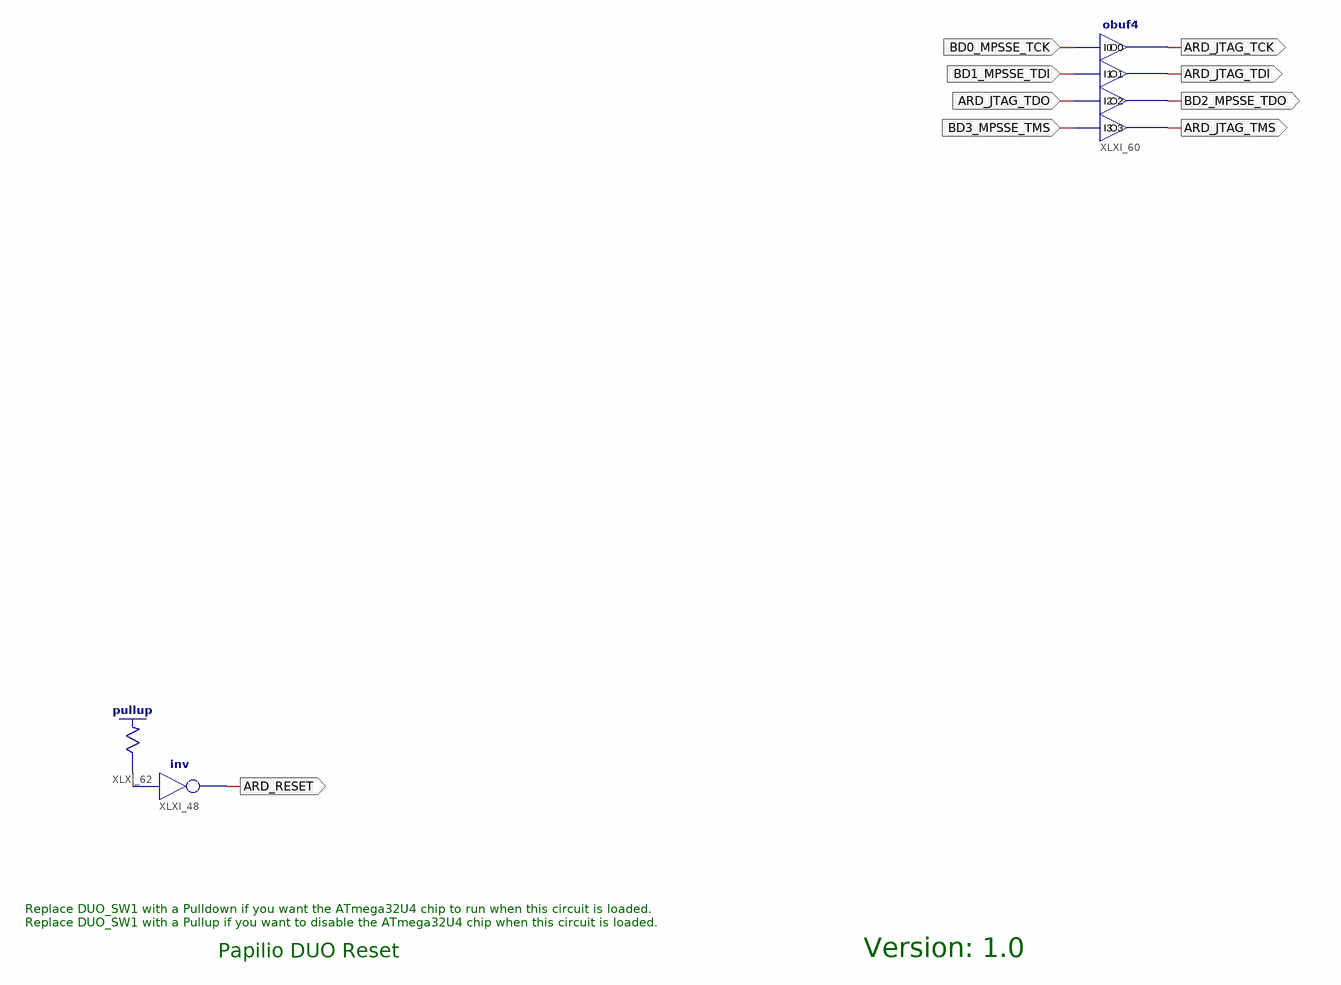
[diagram p0: schematic sheet 1]
// Xilinx ISE schematic Papilio_DUO_LX9.sch (spartan6) as structural Verilog: 3 symbols, 9 ports
module Papilio_DUO_LX9 (
  input  BD0_MPSSE_TCK,
  input  BD1_MPSSE_TDI,
  input  ARD_JTAG_TDO,
  input  BD3_MPSSE_TMS,
  output ARD_RESET,
  output ARD_JTAG_TCK,
  output ARD_JTAG_TDI,
  output BD2_MPSSE_TDO,
  output ARD_JTAG_TMS
);

  wire XLXN_609;

  not XLXI_48 (ARD_RESET, XLXN_609);
  obuf4 XLXI_60 (
    .I0(BD0_MPSSE_TCK), .I1(BD1_MPSSE_TDI), .I2(ARD_JTAG_TDO), .I3(BD3_MPSSE_TMS), .O0(ARD_JTAG_TCK),
    .O1(ARD_JTAG_TDI), .O2(BD2_MPSSE_TDO), .O3(ARD_JTAG_TMS));
  \pullup  XLXI_62 (.O(XLXN_609));

  // Notes on the sheet:
  //   Replace DUO_SW1 with a Pulldown if you want the ATmega32U4 chip to run when this circuit is loaded.
  //   Replace DUO_SW1 with a Pullup if you want to disable the ATmega32U4 chip when this circuit is loaded.
  //   Version: 1.0
  //   Papilio DUO Reset
endmodule
